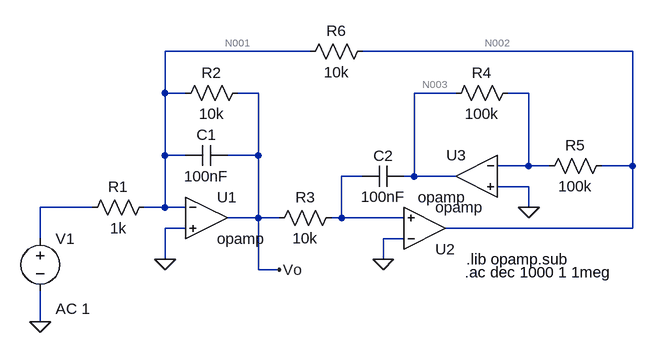
[diagram p0: schematic Pasabanda.asc]
Pasabanda.asc, the LTspice schematic file:
Version 4
SHEET 1 880 680
WIRE 240 -224 16 -224
WIRE 736 -224 320 -224
WIRE 16 -160 16 -224
WIRE 48 -160 16 -160
WIRE 160 -160 128 -160
WIRE 464 -160 400 -160
WIRE 576 -160 544 -160
WIRE 16 -64 16 -160
WIRE 48 -64 16 -64
WIRE 160 -64 160 -160
WIRE 160 -64 112 -64
WIRE 576 -48 576 -160
WIRE 576 -48 528 -48
WIRE 608 -48 576 -48
WIRE 736 -48 736 -224
WIRE 736 -48 688 -48
WIRE 320 -32 288 -32
WIRE 400 -32 400 -160
WIRE 400 -32 384 -32
WIRE 464 -32 400 -32
WIRE 576 -16 528 -16
WIRE -96 16 -176 16
WIRE 16 16 16 -64
WIRE 16 16 -16 16
WIRE 48 16 16 16
WIRE 576 16 576 -16
WIRE 160 32 160 -64
WIRE 160 32 112 32
WIRE 192 32 160 32
WIRE 288 32 288 -32
WIRE 288 32 272 32
WIRE 384 32 288 32
WIRE 48 48 16 48
WIRE 736 48 736 -48
WIRE 736 48 448 48
WIRE -176 64 -176 16
WIRE 384 64 352 64
WIRE 16 96 16 48
WIRE 352 96 352 64
WIRE 160 112 160 32
WIRE 192 112 160 112
WIRE -176 192 -176 144
FLAG 576 16 0
FLAG 352 96 0
FLAG 16 96 0
FLAG -176 192 0
FLAG 192 112 Vo
SYMBOL OpAmps\\opamp 80 -32 R0
SYMATTR InstName U1
SYMBOL OpAmps\\opamp 416 112 M180
SYMATTR InstName U2
SYMBOL OpAmps\\opamp 496 -96 M0
SYMATTR InstName U3
SYMBOL voltage -176 48 R0
WINDOW 123 24 124 Left 2
WINDOW 39 0 0 Left 0
SYMATTR InstName V1
SYMATTR Value ""
SYMATTR Value2 AC 1
SYMBOL res 0 0 R90
WINDOW 0 0 56 VBottom 2
WINDOW 3 32 56 VTop 2
SYMATTR InstName R1
SYMATTR Value 1k
SYMBOL res 144 -176 R90
WINDOW 0 0 56 VBottom 2
WINDOW 3 32 56 VTop 2
SYMATTR InstName R2
SYMATTR Value 10k
SYMBOL res 288 16 R90
WINDOW 0 0 56 VBottom 2
WINDOW 3 32 56 VTop 2
SYMATTR InstName R3
SYMATTR Value 10k
SYMBOL res 560 -176 R90
WINDOW 0 0 56 VBottom 2
WINDOW 3 32 56 VTop 2
SYMATTR InstName R4
SYMATTR Value 100k
SYMBOL res 704 -64 R90
WINDOW 0 0 56 VBottom 2
WINDOW 3 32 56 VTop 2
SYMATTR InstName R5
SYMATTR Value 100k
SYMBOL res 336 -240 R90
WINDOW 0 0 56 VBottom 2
WINDOW 3 32 56 VTop 2
SYMATTR InstName R6
SYMATTR Value 10k
SYMBOL cap 112 -80 R90
WINDOW 0 0 32 VBottom 2
WINDOW 3 32 32 VTop 2
SYMATTR InstName C1
SYMATTR Value 100nF
SYMBOL cap 384 -48 R90
WINDOW 0 0 32 VBottom 2
WINDOW 3 32 32 VTop 2
SYMATTR InstName C2
SYMATTR Value 100nF
TEXT 480 96 Left 2 !.lib opamp.sub
TEXT 478 116 Left 2 !.ac dec 1000 1 1meg

The netlist it stands for:
* Pasabanda.asc
XU1 N001 0 Vo opamp Aol=100K GBW=10Meg  ; pins invin noninvin out
XU2 0 N005 N002 opamp Aol=100K GBW=10Meg  ; pins invin noninvin out
XU3 N004 0 N003 opamp Aol=100K GBW=10Meg  ; pins invin noninvin out
V1 N006 0 AC 1
R1 N001 N006 1k
R2 Vo N001 10k
R3 N005 Vo 10k
R4 N004 N003 100k
R5 N002 N004 100k
R6 N002 N001 10k
C1 Vo N001 100nF
C2 N003 N005 100nF
.lib opamp.sub
.ac dec 1000 1 1meg
.backanno
.end

* Results of the author's LTspice run, read from the files saved beside the schematic
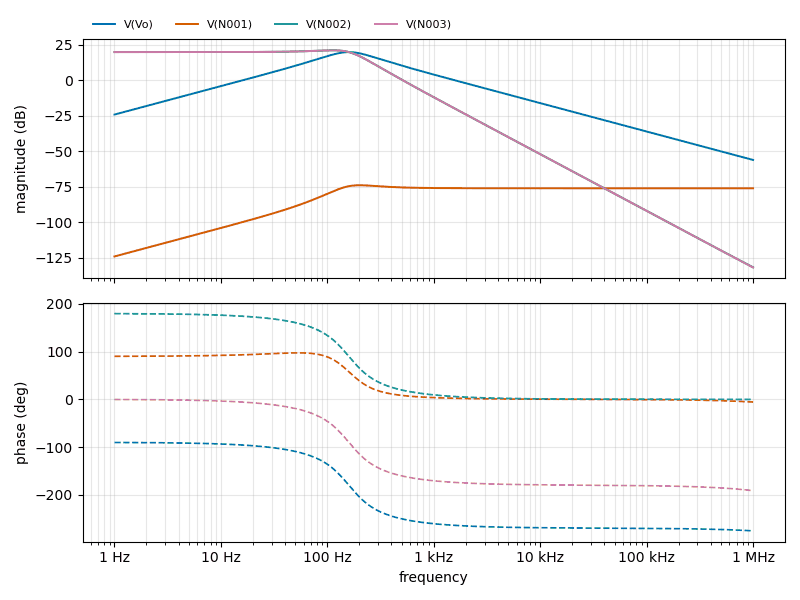
[diagram p1: AC Analysis of Pasabanda.asc, plotted from the saved traces]
* AC Analysis, 1 run:
*   V(Vo): -24.04 dB at 1 Hz, -56.01 dB at 1 MHz, peak 20.00 dB at 159.2 Hz, 3 dB below the peak at 98.35 Hz and 257.5 Hz
*   V(N001): -124.03 dB at 1 Hz, -76.01 dB at 1 MHz, peak -73.85 dB at 201.8 Hz, 3 dB below the peak at 124.8 Hz
*   V(N002): 20.00 dB at 1 Hz, -131.67 dB at 1 MHz, peak 21.25 dB at 112.5 Hz, 3 dB below the peak at 186 Hz
*   V(N003): 20.00 dB at 1 Hz, -131.84 dB at 1 MHz, peak 21.25 dB at 112.5 Hz, 3 dB below the peak at 186 Hz